# EAGLE design LW upconverter (EAGLE 9.6.2)
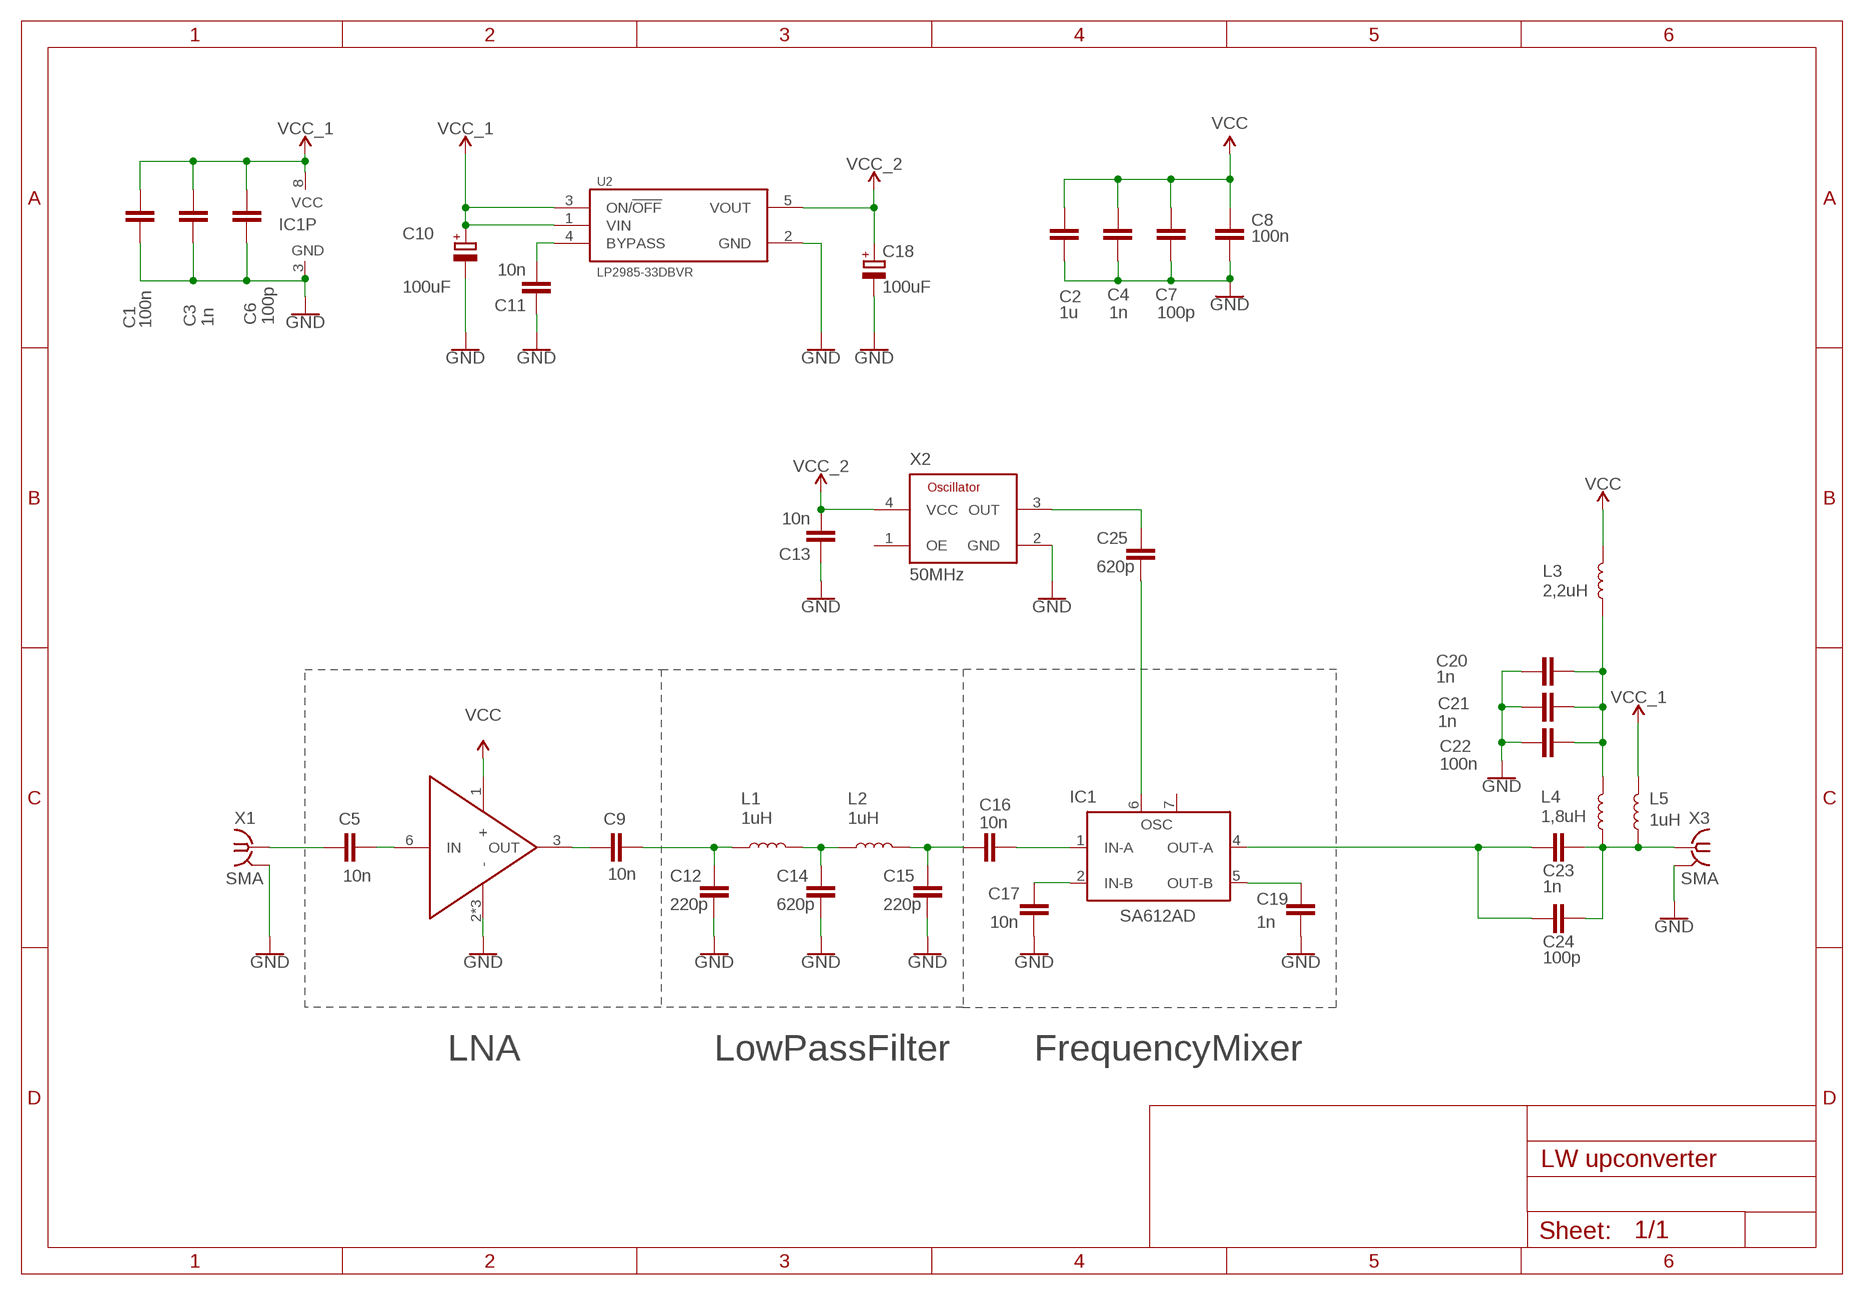
[diagram p0: schematic, sheet 1]

## Parts
C1  100n  C-EUC0603K  [C0603K]
C2  1u  C-EUC0603K  [C0603K]
C3  1n  C-EUC0603K  [C0603K]
C4  1n  C-EUC0603K  [C0603K]
C5  10n  C-EUC0603K  [C0603K]
C6  100p  C-EUC0603K  [C0603K]
C7  100p  C-EUC0603K  [C0603K]
C8  100n  C-EUC0603K  [C0603K]
C9  10n  C-EUC0603K  [C0603K]
C10  100uF  CPOL-EUCT3528  [CT3528]
C11  10n  C-EUC0603K  [C0603K]
C12  220p  C-EUC0603K  [C0603K]
C13  10n  C-EUC0603K  [C0603K]
C14  620p  C-EUC0603K  [C0603K]
C15  220p  C-EUC0603K  [C0603K]
C16  10n  C-EUC0603K  [C0603K]
C17  10n  C-EUC0603K  [C0603K]
C18  100uF  CPOL-EUCT3528  [CT3528]
C19  1n  C-EUC0603K  [C0603K]
C20  1n  C-EUC0603K  [C0603K]
C21  1n  C-EUC0603K  [C0603K]
C22  100n  C-EUC0603K  [C0603K]
C23  1n  C-EUC0603K  [C0603K]
C24  100p  C-EUC0603K  [C0603K]
C25  620p  C-EUC0603K  [C0603K]
IC1  SA612AD  [SO08]
L1  1uH  INDUCTOR-0603-33NH  [0603]
L2  1uH  INDUCTOR-0603-33NH  [0603]
L3  2,2uH  INDUCTOR-0603-33NH  [0603]
L4  1,8uH  INDUCTOR-0603-33NH  [0603]
L5  1uH  INDUCTOR-0603-33NH  [0603]
U1  BGA28XX_BGA28XX  [BGA28XX_SOT363_PHILIPS]
U2  LP2985-33DBVR  [SOT95P280X145-5N]
X1  SMA  SMA-142-0711-881/886  [J502-ND-142-0711-881/886]
X2  50MHz  OSCILLATORS-1  [ASF1_ASFL_ASFL1]
X3  SMA  SMA-142-0711-881/886  [J502-ND-142-0711-881/886]

## Nets
GND: C1.2 C2.2 C3.2 C4.2 C6.2 C7.2 C8.1 C10.- C11.1 C12.1 C13.1 C14.1 C15.1 C17.1 C18.- C19.1 C20.2 C21.2 C22.2 IC1.3(GND) U1.2(-) U1.4(-) U1.5(-) U2.2(GND) X1.G@1 X1.G@2 X1.G@3 X1.G@4 X2.2(GND) X3.G@1 X3.G@2 X3.G@3 X3.G@4
N$1: C23.1 C24.1 L4.1 L5.1 X3.1
N$2: C14.2 L1.2 L2.1
N$3: C15.2 C16.2 L2.2
N$4: C17.2 IC1.2(IN-B)
N$5: C19.2 IC1.5(OUT-B)
N$6: C23.2 C24.2 IC1.4(OUT-A)
N$7: C9.1 U1.3(OUT)
N$8: C16.1 IC1.1(IN-A)
N$9: C5.2 U1.6(IN)
N$10: C5.1 X1.1
N$11: C9.2 C12.2 L1.1
N$12: C20.1 C21.1 C22.1 L3.1 L4.2
N$13: C11.2 U2.4(BYPASS)
N$14: C25.2 X2.3(OUT)
N$15: C25.1 IC1.6(OSC)
VCC: C2.1 C4.1 C7.1 C8.2 L3.2 U1.1(+)
VCC_1: C1.1 C3.1 C6.1 C10.+ IC1.8(VCC) L5.2 U2.1(VIN) U2.3(ON/!OFF)
VCC_2: C13.2 C18.+ U2.5(VOUT) X2.4(VCC)
Unconnected: IC1.7(OSC') X2.1(OE)

## Notes on the sheet
- LNA | LowPassFilter | FrequencyMixer

## Library data of the parts
C1-C9 C11-C17 C19-C25 = rcl:C-EU: CAPACITOR, European symbol; SPICEPREFIX: C
C10 C18 = rcl:CPOL-EU: POLARIZED CAPACITOR, European symbol; SPICEPREFIX: C
IC1 = linear:SA612A: Double-balanced mixer and oscillator NE612/SA612 Source: www-eu2.semiconductors.philips.com/acrobat/datasheets/SA612A.pdf
L1-L5 = SparkFun-Coils:INDUCTOR: Inductors Resist changes in electrical current. Basically a coil of wire. SparkFun Products: SparkFun Load Cell Amplifier - HX711 <https://www.sparkfun.com/products/13879> IOIO-OTG - V2.2 <https://www.sparkfun.com/products/13613>; PROD_ID: NDUC-07874; VALUE: 33nH/±5%/500mA
U1 = BGA28xx:BGA28XX_BGA28XX
U2 = LP2985-33DBVR:LP2985-33DBVR: LP2985 150-mA Low-noise Low-dropout Regulator With Shutdown; AVAILABILITY: Unavailable; DESCRIPTION: Linear Voltage Regulator IC 1 Output 150mA SOT-23-5; DIGIKEY-PURCHASE-URL: https://snapeda.com/shop?store=DigiKey&id=185026; MF: Texas Instruments; MP: LP2985-33DBVR; PACKAGE: SOT-23 Texas Instruments; PRICE: None
X1 X3 = con-coax:SMA-: SMA 50 Ohm End Launch Jack Receptacle - Round Contact Johnson Components Source: www.johnsoncomponents.com .. J502-ND.pdf; MF: JOHNSON COMPONENTS; MPN: 142-0711-881; OC_FARNELL: unknown; OC_NEWARK: 50B4464
X2 = PowerPack_PAD:OSCILLATORS: Various Osccilators from various manufactures in various packages

## Board
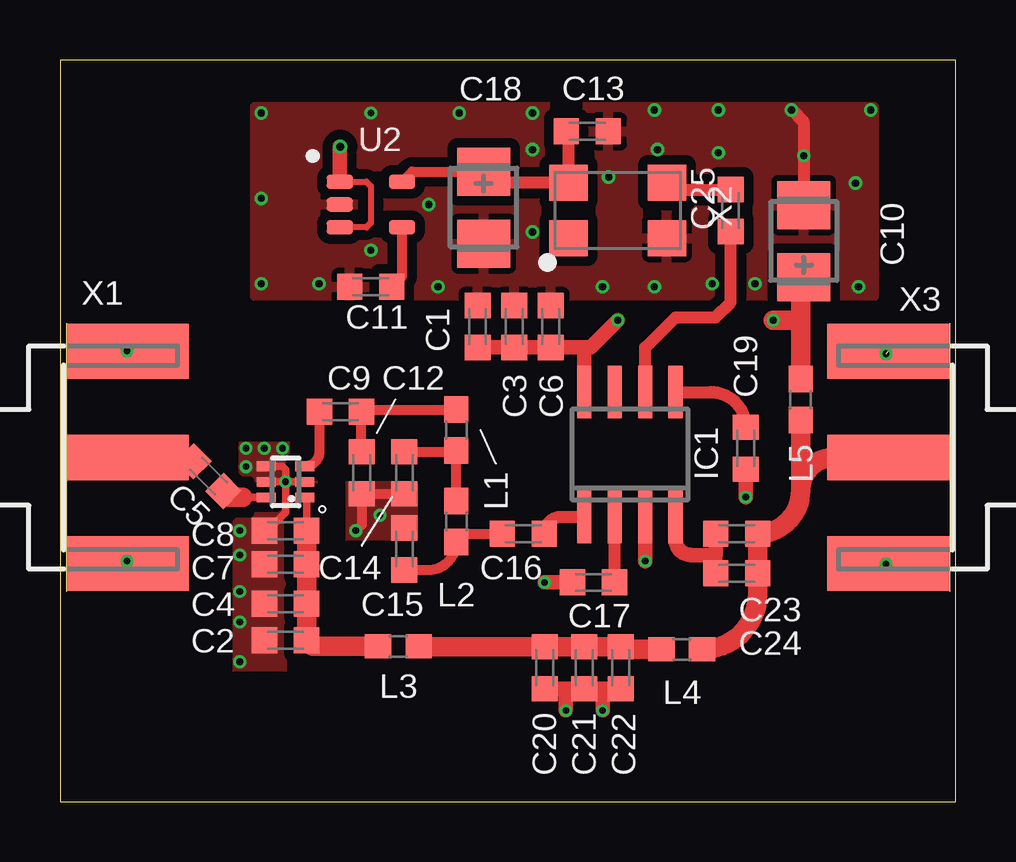
[diagram p1: board, top side]
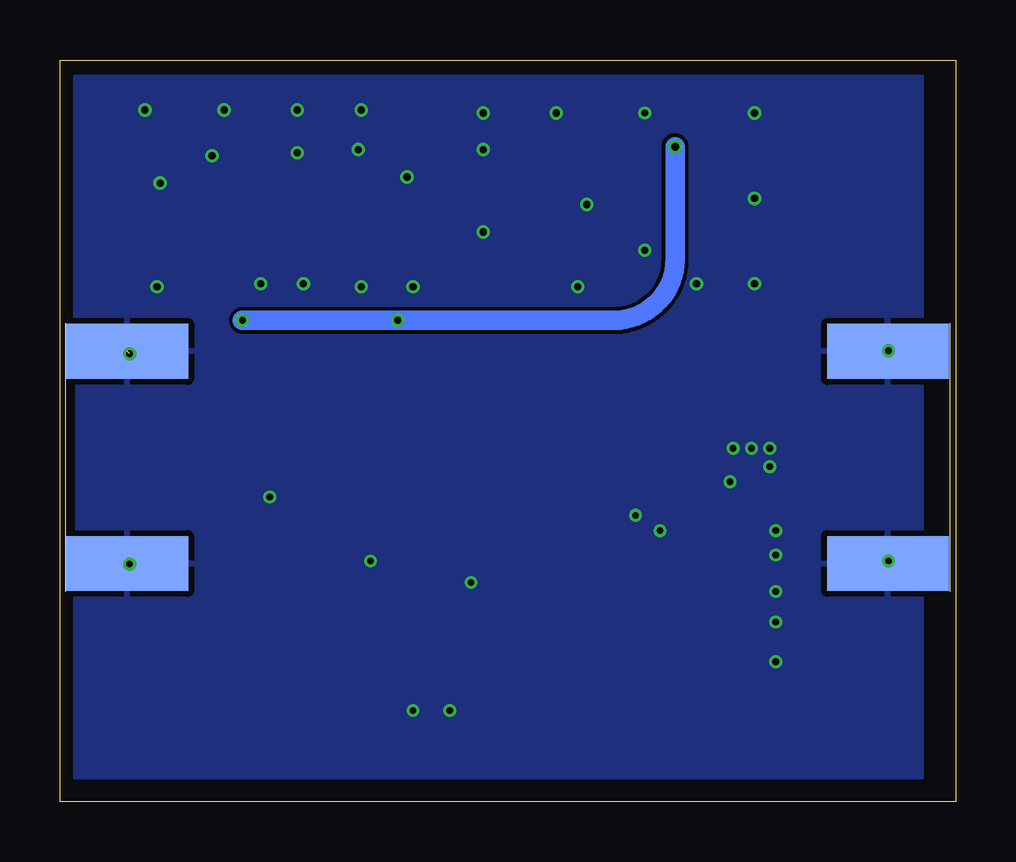
[diagram p2: board, bottom side, seen from below]

Size 37.32 x 30.91 mm. Coordinates in mm from the lower left corner, seen from the top.
Outline: 0,0 37.32,0 37.32,30.91 0,30.91 0,0
Copper layers (1*16): Top 0.035559375mm / dielectric 1.6mm / Bottom 0.035559375mm
Design rules "oshpark-2layer": minimum track width 6mil, minimum drill 10mil, track to track 6mil, track to pad 6mil, pad to pad 6mil, via to via 6mil, smd to smd 6mil, copper to edge 15mil, drill to drill 6mil, minimum pad ring 5mil, minimum via ring 5mil, stop-mask expansion 2.5mil, vias tented up to drill 13mil, thermal gap 10mil

### Footprints (pad centres in the part's own frame; a part is rotated, then mirrored left to right if it is on the bottom)
C0603K = smd 1.05 x 1.08: 1 -0.875,0; 2 0.875,0
CT3528 = smd 2 x 2.2: + -1.5,0; - 1.5,0
SO08 = smd 0.6 x 2.2: 1 -1.905,-2.6; 2 -0.635,-2.6; 3 0.635,-2.6; 4 1.905,-2.6; 5 1.905,2.6; 6 0.635,2.6; 7 -0.635,2.6; 8 -1.905,2.6
0603 = smd 1.1 x 1: 1 -0.85,0; 2 0.85,0
BGA28XX_SOT363_PHILIPS = smd 0.4 x 0.8: 1 -0.65,-0.8; 2 0,-0.8; 3 0.65,-0.8; 4 0.65,0.8; 5 0,0.8; 6 -0.65,0.8
SOT95P280X145-5N = smd 1.1 x 0.6: 1 -1.3,0.95; 2 -1.3,0; 3 -1.3,-0.95; 4 1.3,-0.95; 5 1.3,0.95
J502-ND-142-0711-881/886 = smd 5.08 x 1.905: 1 2.565,0 | smd 5.08 x 2.286: G@1 2.565,4.42; G@2 2.565,-4.42 | smd 5.08 x 2.286 bottom: G@3 2.565,4.42; G@4 2.565,-4.42
ASF1_ASFL_ASFL1 = smd 1.6 x 1.5: 1 -2.05,-1.15; 2 2.05,-1.15; 3 2.05,1.15; 4 -2.05,1.15

### Placement (x,y rotation side)
C1  17.4,19.81 90 top
C2  9.4,6.73 180 top
C3  18.92,19.81 90 top
C4  9.4,8.26 180 top
C5  6.19,13.57 315 top
C6  20.45,19.81 90 top
C7  9.4,9.91 180 top
C8  9.4,11.3 0 top
C9  11.68,16.26 0 top
C10  30.99,23.37 90 top
C11  12.95,21.46 0 top
C12  12.57,13.72 90 top
C13  21.97,27.94 180 top
C14  14.35,13.72 90 top
C15  14.35,10.54 270 top
C16  19.3,11.18 180 top
C17  22.23,9.14 0 top
C18  17.65,24.77 270 top
C19  28.57,14.73 90 top
C20  20.19,5.59 270 top
C21  21.84,5.59 270 top
C22  23.37,5.59 270 top
C23  28.19,11.18 180 top
C24  28.19,9.53 180 top
C25  27.94,24.64 90 top
IC1  23.75,14.48 0 top
L1  16.51,15.49 270 top
L2  16.51,11.68 270 top
L3  14.1,6.48 180 top
L4  25.91,6.35 180 top
L5  30.86,16.76 90 top
U1  9.4,13.33 90 top
U2  12.95,24.89 0 top
X1  0.25,14.35 0 top
X2  23.24,24.64 0 top
X3  37.08,14.35 180 top

### Tracks (layer width: path | path; a pad name or v marks a point on that pad's centre or on a via)
GND  (via drill 0.28, 0.3)  (5 unrouted)
  Top 0.305: U1.5 v9.4,13.33 | v9.4,13.33 U1.2 | U1.4 9.26,13.98 9.4,13.84 v9.4,13.33 | v9.4,13.33 9.4,12.06 8.64,11.3 C8.1
  Top 0.406: v12.32,11.3 12.57,11.56 C12.1 C14.1
  Top 0.508: v30.99,26.92 C10.- 30.99,28.32 v30.48,28.83 | C19.1 28.57,13.84
  Top 0.61: v24.38,10.03 IC1.3 | v20.19,9.14 C17.1 | v28.57,12.7 C19.1 | C20.2 21.08,4.71 | 21.08,4.71 C21.2 22.61,4.71 | 22.61,4.71 C22.2 | v22.61,3.81 22.61,4.71 | v21.08,3.81 21.08,4.71
  other vias: 7.49,8.76 7.49,11.3 7.75,14.73 8.51,14.73 7.75,13.97 9.27,14.73 7.49,10.29 10.8,21.59 15.75,21.46 22.61,21.46 8.38,21.59 8.38,28.7 8.38,25.15 12.95,28.7 16.64,28.7 19.69,28.7 19.69,27.18 22.86,26.04 24.77,28.83 27.43,28.83 33.78,28.83 33.15,25.78 33.27,21.46 28.96,21.59 27.18,21.59 24.77,21.46 27.43,27.05 7.49,7.49 7.49,5.84 12.95,22.99 24.89,27.18 19.69,23.75 15.37,24.89 13.34,11.94 2.79,18.8 2.79,10.03 34.42,18.67 34.42,9.91
  pour Top (isolate 0.406, rank 3, no thermals): 7.49,14.99 9.52,14.99 9.52,13.97 10.67,13.97 10.67,12.7 9.4,12.7 9.4,5.46 7.24,5.46 7.24,11.68 7.37,11.81 8,11.81 8.13,11.94 8.13,13.46 8,13.59 7.62,13.59 7.49,13.72
  pour Top (no thermals): 11.94,13.33 14.86,13.33 14.86,13.21 14.86,10.92 11.94,10.92
  pour Bottom: 1.4,30.23 36.7,30.23 36.7,1.02 1.4,1.02
  pour Top (isolate 0.406): 8.13,28.96 33.91,28.96 33.91,21.08 8.13,21.08
  pour Top (isolate 0.406, rank 3): 7.49,14.99 9.52,14.99 9.52,13.97 10.67,13.97 10.67,12.7 9.4,12.7 9.4,5.46 7.24,5.46 7.24,11.68 7.37,11.81 8,11.81 8.13,11.94 8.13,13.46 8,13.59 7.62,13.59 7.49,13.72
  pour Top (isolate 0.406, rank 3, no thermals): 10.67,14.61 10.67,12.06 8.13,12.06
N$1
  Top 0.406: C23.1 arc-90 29.08,11.16 arc90 29.07,11.15
  Top 0.813: C23.1 arc90 30.86,12.97 | 30.86,12.97 L5.1 | X3.1 32.24,14.35 arc90 30.86,12.97 | L4.1 arc90 29.07,8.66 C24.1 29.07,11.15 29.08,11.16
N$2
  Top 0.406: C14.2 16.46,14.59 | 16.46,14.59 arc90 L1.2 | L2.1 16.51,14.54 arc90 16.46,14.59
N$3
  Top 0.406: C15.2 15.34,9.67 arc90 L2.2 arc-90 16.85,11.18 C16.2
N$4
  Top 0.508: C17.2 23.11,9.14 IC1.2
N$5
  Top 0.508: IC1.5 27.1,17.08 arc-90 C19.2
N$6
  Top 0.61: 27.3,10.29 26.29,10.29 arc-90 25.65,10.92 IC1.4 | 27.3,10.29 27.32,10.3 C23.2 | C24.2 27.3,9.54 27.3,10.29
N$7
  Top 0.406: C9.1 10.81,14.6 arc-90 U1.3
N$8
  Top 0.508: C16.1 arc-90 20.88,11.88 IC1.1
N$9
  Top 0.305: 7.62,12.7 8.58,12.7 U1.6
  Top 0.813: C5.2 7.06,12.7 7.62,12.7
N$10
  Top 0.406: C5.1 2.98,14.19 arc90 X1.1
N$11
  Top 0.406: C12.2 12.56,14.61 C9.2 arc-90 12.65,16.34 L1.1
N$12
  Top 0.406: 23.48,6.35 arc-90 C22.1 | 20.18,6.48 arc-90 C20.1
  Top 0.813: L4.2 23.48,6.35 | C22.1 C21.1 C20.1 | C20.1 20.18,6.48 | C20.1 14.96,6.46 L3.1
N$13
  Top 0.406: C11.2 14.25,21.89 U2.4
N$14
  Top 0.508: 25.29,25.41 X2.3 25.57,25.51 C25.2
N$15
  Top 0.508: IC1.6 24.38,18.92 25.65,20.19 27.3,20.19 27.94,20.83 C25.1
VCC
  Top 0.305: U1.1 10.27,12.61 C8.2
  Top 0.406: 10.29,11.29 arc90 C8.2 10.27,11.18 | 10.53,6.48 arc-90 C2.1
  Top 0.813: L3.2 10.53,6.48 C2.1 C4.1 C7.1 10.27,11.18
VCC_1  (via drill 0.28, 0.33)
  Top 0.254: U2.1 12.77,25.84 12.95,25.65 12.95,24.13 12.77,23.94 U2.3
  Top 0.305: 11.62,27.3 11.65,27.28
  Top 0.406: 30.86,21.74 arc-90 C10.+
  Top 0.61: U2.1 11.65,27.28 arc-90 v11.68,27.3 | C1.1 C3.1 C6.1 21.72,18.94 | 21.72,18.94 22.11,18.94 v23.24,20.07 | IC1.8 21.84,18.81 21.72,18.94
  Top 0.813: L5.2 30.86,20.07 | 30.86,20.07 30.86,21.74 C10.+ | v29.72,20.07 30.86,20.07
  Bottom 0.813: v29.72,20.07 v23.24,20.07 14.22,20.07 arc-90 11.68,22.61 v11.68,27.3
VCC_2
  Top 0.406: U2.5 14.68,26.27 C18.+
  Top 0.508: C13.2 21.19,27.85 X2.4 18.13,25.79 C18.+

### Text on the board
bStop: m6r3k @2021